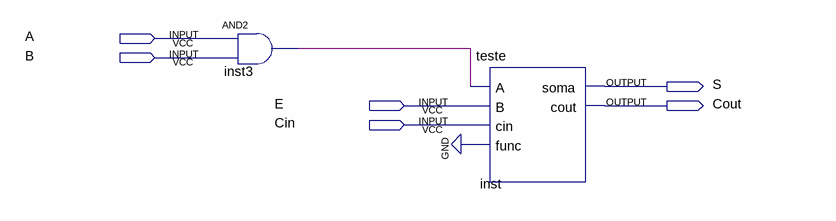
[diagram p0: schematic sheet]
// Quartus schematic blocomultiplicador.bdf as structural Verilog: 2 symbols, 6 pins
module blocomultiplicador (
  input  A,
  input  B,
  input  E,
  input  Cin,
  output S,
  output Cout
);

  wire inst3_out;

  and inst3 (inst3_out, A, B);
  teste inst (.A(inst3_out), .B(E), .cin(Cin), .func(1'b0), .soma(S), .cout(Cout));
endmodule
